# Altium schematic sheet MotorController.SchDoc
size A; SheetNumber: 3; SheetTotal: 11
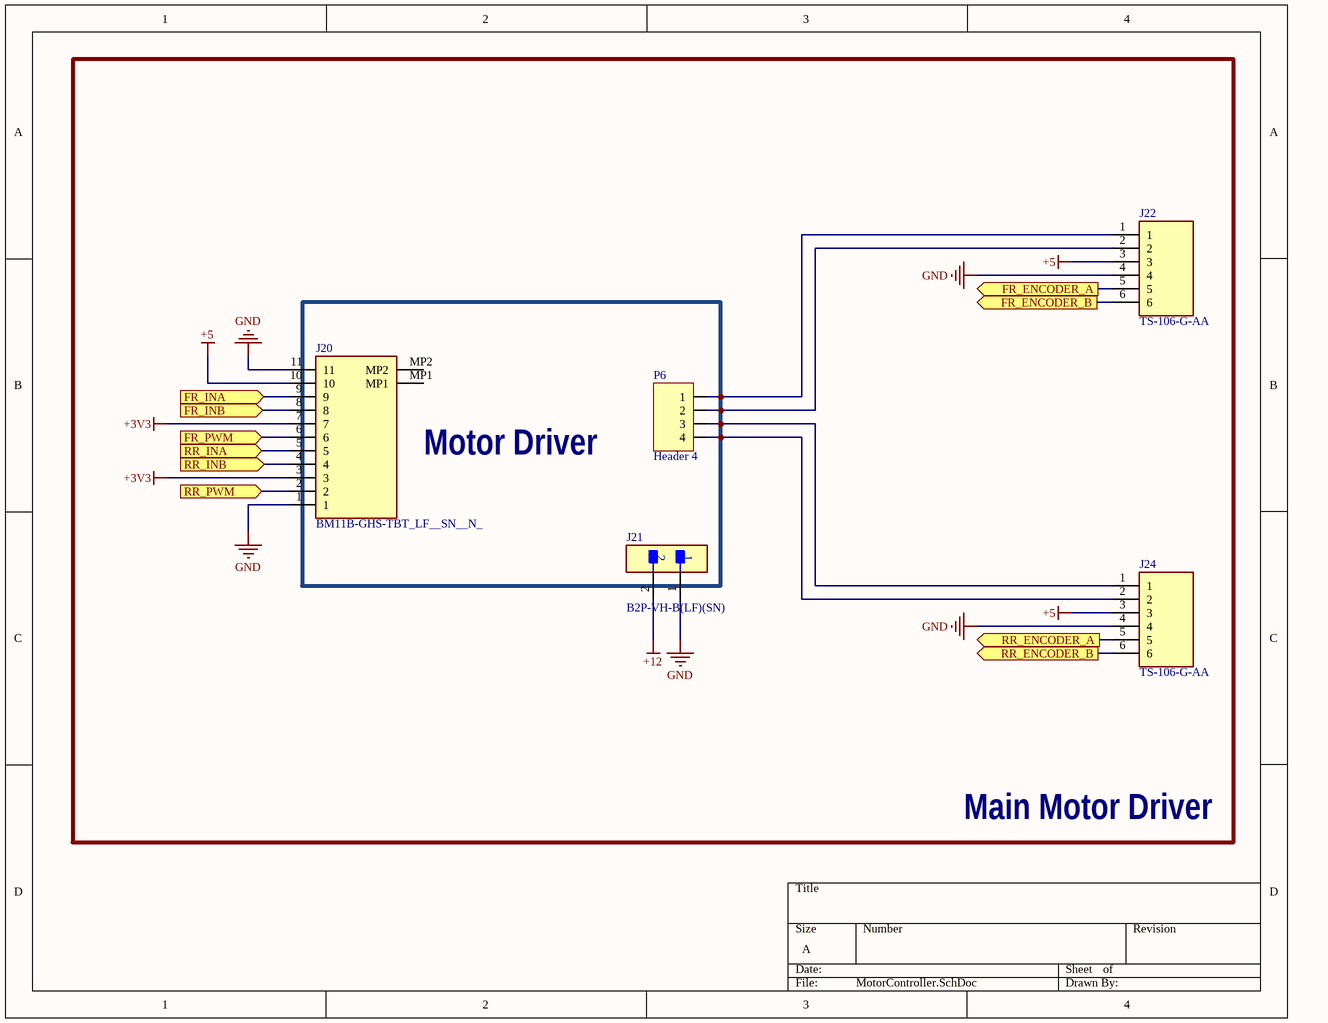
[diagram p0: MotorController.SchDoc]

## Parts
J20  BM11B-GHS-TBT_LF__SN__N_  [BM11BGHSTBTLFSNN]
J21  B2P-VH-B(LF)(SN)  [FP-B2P-VH-B_LF_SN-MFG]
J22  TS-106-G-AA  [HDRV6W46P0X254_1X6_1524X254X676P]
J24  TS-106-G-AA  [HDRV6W46P0X254_1X6_1524X254X676P]
P6  Header 4  [HDR1X4]

## Blocks framed on the sheet
Main Motor Driver: J22 J24
Motor Driver: J20 J21 P6

## Ports
FR_ENCODER_A (out, see Main[4B], MicroController[1B]), FR_ENCODER_B (out, see Main[4B], MicroController[1B]), FR_INA (in, see Main[4B], MicroController[2C]), FR_INB (in, see Main[4C], MicroController[2C]), FR_PWM (in, see Main[4C], MicroController[1D]), RR_ENCODER_A (out, see Main[4B], MicroController[1B]), RR_ENCODER_B (out, see Main[4B], MicroController[1B]), RR_INA (in, see Main[4C], MicroController[2C]), RR_INB (in, see Main[4C], MicroController[2C]), RR_PWM (in, see Main[4C], MicroController[1D])

## Nets
+3V3: J20.3 J20.7
+5: J20.10 J22.3 J24.3
+12: J21.2
GND: J20.1 J20.11 J21.1 J22.4 J24.4
FR_ENCODER_A: J22.5 ; port FR_ENCODER_A
FR_ENCODER_B: J22.6 ; port FR_ENCODER_B
FR_INA: J20.9 ; port FR_INA
FR_INB: J20.8 ; port FR_INB
FR_PWM: J20.6 ; port FR_PWM
RR_ENCODER_A: J24.5 ; port RR_ENCODER_A
RR_ENCODER_B: J24.6 ; port RR_ENCODER_B
RR_INA: J20.5 ; port RR_INA
RR_INB: J20.4 ; port RR_INB
RR_PWM: J20.2 ; port RR_PWM
NetJ22_1: J22.1 P6.1
NetJ22_2: J22.2 P6.2
NetJ24_1: J24.1 P6.3
NetJ24_2: J24.2 P6.4

Not connected (* = marked no-connect by the designer): J20 MP1 MP2

## Library data of the parts
J20 = BM11B-GHS-TBT_LF__SN__N_: Connector; Manufacturer_Name: JST (JAPAN SOLDERLESS TERMINALS); Manufacturer_Part_Number: BM11B-GHS-TBT(LF)(SN)(N); Datasheet Link: http://www.jst-mfg.com/product/pdf/eng/eGH.pdf; Height: 4.35mm; Mouser Part Number: N/A; Mouser Price/Stock: https://www.mouser.com/Search/Refine.aspx?Keyword=N%2FA
J21 = CMP-17439-000297-1: CONN HEADER VERT 2POS 3.96MM; Number of Positions: 2; Pitch: 0.156inch; Voltage Rating: 250V; Termination: Solder; Lead Free: Lead Free; Insulation Color: Natural; Contact Material: Brass; Flammability Rating: UL94 V-0; Packaging: Bulk; Contact Mating Length: 0.303inch; Color: Natural; Contact Shape: Square; Contact Plating: Tin; Number of Rows: 1; Insulation Material: PBT; Connector Type: Header; Contact Finish - Mating: TIN; Mount: Through Hole; Fastening Type: Friction; Contact Type: Male Pin; Series: VH
J22 J24 = TS-106-G-AA: Connector; Manufacturer_Name: SAMTEC; Datasheet Link: http://suddendocs.samtec.com/catalog_english/ts.pdf; Height: 6.76mm; Manufacturer_Part_Number: TS-106-G-AA; Mouser Part Number: 200-TS106GAA; Mouser Price/Stock: https://www.mouser.com/Search/Refine.aspx?Keyword=200-TS106GAA; Arrow Part Number: TS-106-G-AA; Arrow Price/Stock: https://www.arrow.com/en/products/ts-106-g-aa/samtec
P6 = Header 4: Header, 4-Pin; LatestRevisionDate: 17-Jul-2002; LatestRevisionNote: Re-released for DXP Platform.; Publisher: Altium Limited